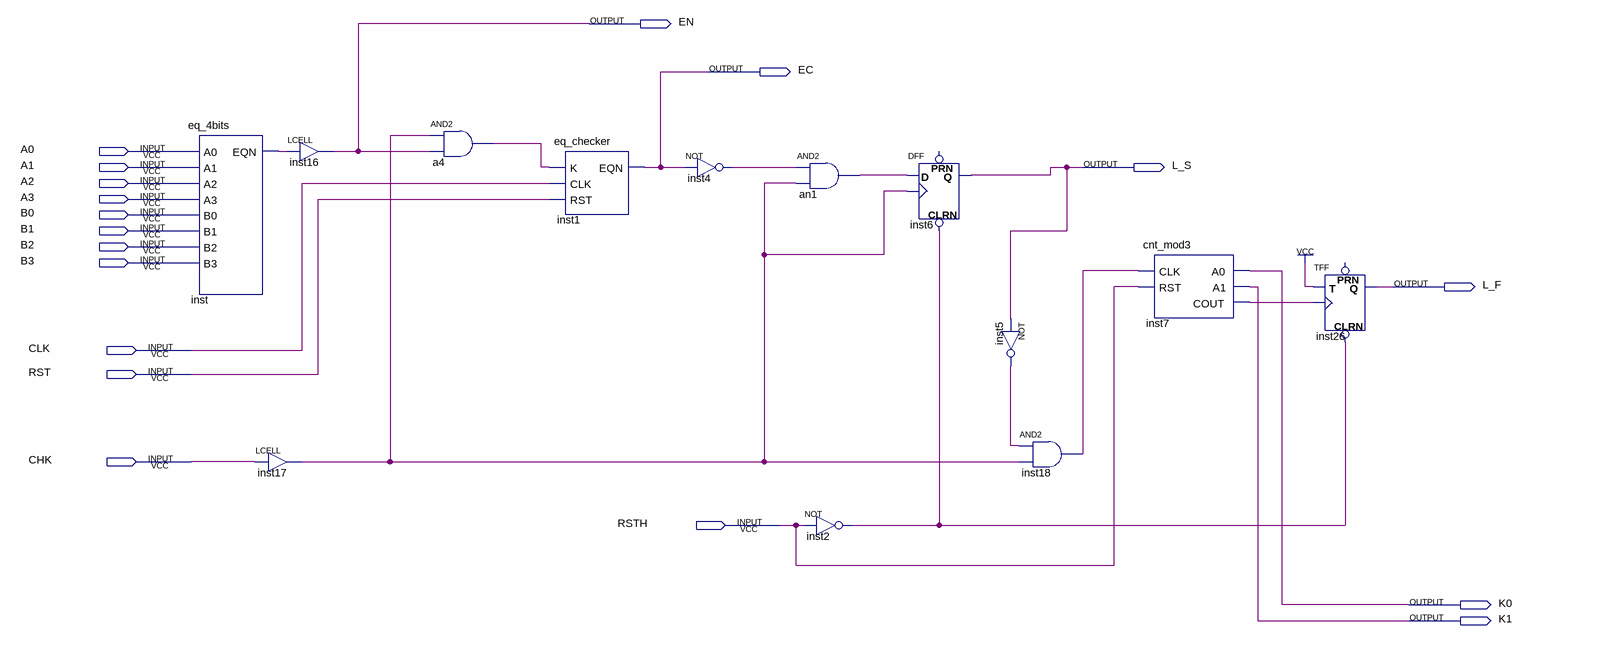
[diagram p0: schematic sheet]
// Quartus schematic pass_chk.bdf as structural Verilog: 13 symbols, 18 pins
module pass_chk (
  input  A0,
  input  A1,
  input  A2,
  input  A3,
  input  B0,
  input  B1,
  input  B2,
  input  B3,
  input  CLK,
  input  RST,
  input  CHK,
  input  RSTH,
  output EN,
  output EC,
  output L_S,
  output L_F,
  output K0,
  output K1
);

  wire a4_out, an1_out, inst2_out, inst4_out, inst5_out, inst7_cout, inst17_out, inst18_out, inst_eqn;

  eq_4bits inst (.A0(A0), .A1(A1), .A2(A2), .A3(A3), .B0(B0), .B1(B1), .B2(B2), .B3(B3), .EQN(inst_eqn));
  LCELL inst16 (.IN(inst_eqn), .OUT(EN));
  LCELL inst17 (.IN(CHK), .OUT(inst17_out));
  and a4 (a4_out, inst17_out, EN);
  eq_checker inst1 (.K(a4_out), .CLK(CLK), .RST(RST), .EQN(EC));
  not inst4 (inst4_out, EC);
  and an1 (an1_out, inst4_out, inst17_out);
  not inst2 (inst2_out, RSTH);
  DFF inst6 (.CLRN(inst2_out), .CLK(inst17_out), .D(an1_out), .Q(L_S));  // open: PRN
  not inst5 (inst5_out, L_S);
  and inst18 (inst18_out, inst5_out, inst17_out);
  cnt_mod3 inst7 (.CLK(inst18_out), .RST(RSTH), .A0(K0), .A1(K1), .COUT(inst7_cout));
  TFF inst26 (.CLRN(inst2_out), .T(1'b1), .CLK(inst7_cout), .Q(L_F));  // open: PRN
endmodule
